# Altium project FYP_Protoboard1.PrjPcb
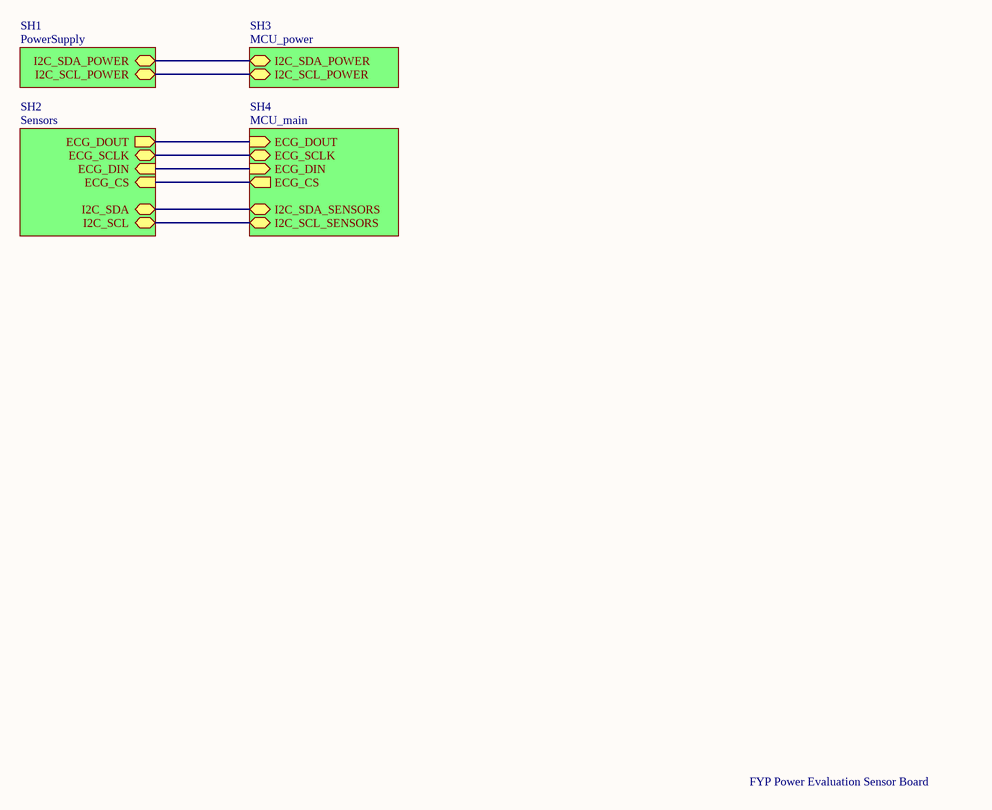
[diagram p0: Sensors_Power_Characterisation_Board.SchDoc]
Author: Petar Barakov; Revision: Rev 1
4 sheets, 126 parts. Net scope: hierarchical (ports join the sheet entries above them; power ports are global).
Board file: Sensors_Power_Characterisation_Board.PcbDoc
Sheets:
  Sensors_Power_Characterisation_Board.SchDoc
    SH1 = PowerSupply.SchDoc
    SH2 = Sensors.SchDoc
    SH4 = MCU_main.SchDoc

## Sheet Sensors_Power_Characterisation_Board.SchDoc
size A4; SheetNumber: 1; SheetTotal: 5

### Sub-sheets
SH1 = PowerSupply: I2C_SDA_POWER (bidir), I2C_SCL_POWER (bidir)
SH2 = Sensors: ECG_DOUT (out), ECG_SCLK (bidir), ECG_DIN (in), ECG_CS (in), I2C_SCL (bidir), I2C_SDA (bidir)
SH3 = MCU_power (file not in this document): I2C_SDA_POWER (bidir), I2C_SCL_POWER (bidir)
SH4 = MCU_main: ECG_DIN (in), ECG_CS (out), ECG_SCLK (bidir), I2C_SDA_SENSORS (bidir), I2C_SCL_SENSORS (bidir), ECG_DOUT (in)

### Nets
ECG_CS: sheet SH2/ECG_CS, sheet SH4/ECG_CS
ECG_DIN: sheet SH2/ECG_DIN, sheet SH4/ECG_DIN
ECG_DOUT: sheet SH2/ECG_DOUT, sheet SH4/ECG_DOUT
ECG_SCLK: sheet SH2/ECG_SCLK, sheet SH4/ECG_SCLK
I2C_SCL: sheet SH2/I2C_SCL, sheet SH4/I2C_SCL_SENSORS
I2C_SCL_POWER: sheet SH1/I2C_SCL_POWER, sheet SH3/I2C_SCL_POWER
I2C_SDA: sheet SH2/I2C_SDA, sheet SH4/I2C_SDA_SENSORS
I2C_SDA_POWER: sheet SH1/I2C_SDA_POWER, sheet SH3/I2C_SDA_POWER

### Notes on the sheet
- FYP Power Evaluation Sensor Board

## Sheet PowerSupply.SchDoc
size A4; SheetNumber: 3; SheetTotal: 5
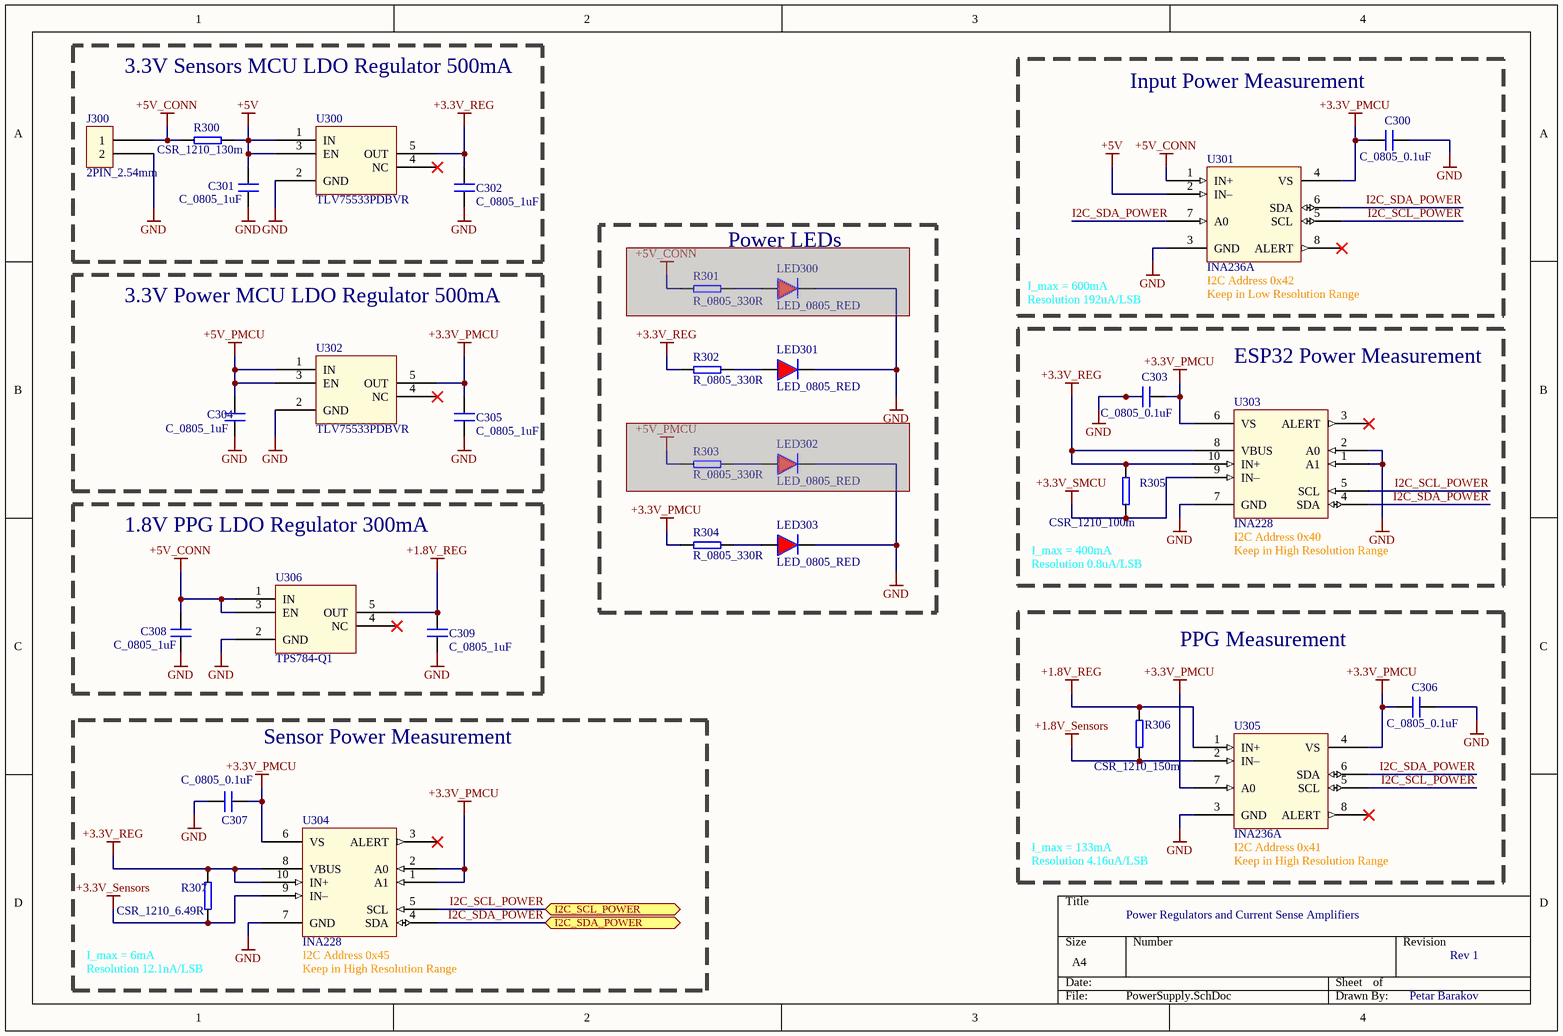
[diagram p1: PowerSupply.SchDoc]

### Parts
C300  C_0805_0.1uF  [CAP_0805]
C301  C_0805_1uF  [CAP_0805]
C302  C_0805_1uF  [CAP_0805]
C303  C_0805_0.1uF  [CAP_0805]
C304  C_0805_1uF  [CAP_0805]
C305  C_0805_1uF  [CAP_0805]
C306  C_0805_0.1uF  [CAP_0805]
C307  C_0805_0.1uF  [CAP_0805]
C308  C_0805_1uF  [CAP_0805]
C309  C_0805_1uF  [CAP_0805]
J300  2PIN_2.54mm  [2PIN_2.54mm-Footprint-1]
LED300  LED_0805_RED  [LED_0806]  (masked out: inside a compile mask, not in the netlist)
LED301  LED_0805_RED  [LED_0806]
LED302  LED_0805_RED  [LED_0806]  (masked out: inside a compile mask, not in the netlist)
LED303  LED_0805_RED  [LED_0806]
R300  CSR_1210_130m  [CSR_1210]
R301  R_0805_330R  [0805_RES]  (masked out: inside a compile mask, not in the netlist)
R302  R_0805_330R  [0805_RES]
R303  R_0805_330R  [0805_RES]  (masked out: inside a compile mask, not in the netlist)
R304  R_0805_330R  [0805_RES]
R305  CSR_1210_100m  [CSR_1210]
R306  CSR_1210_150m  [CSR_1210]
R307  CSR_1210_6.49R  [CSR_1210]
U300  TLV75533PDBVR  [SOT95P280X145-5N]
U301  INA236A  [INA236A-Footprint-1]
U302  TLV75533PDBVR  [SOT95P280X145-5N]
U303  INA228  [TSSOP50P490X110-10N]
U304  INA228  [TSSOP50P490X110-10N]
U305  INA236A  [INA236A-Footprint-1]
U306  TPS784-Q1  [SOT95P280X145-5N]

### Blocks framed on the sheet
3.3V Sensors MCU LDO Regulator 500mA: C301 C302 J300 R300 U300
Input Power Measurement: C300 U301
Power LEDs: LED300-LED303 R301-R304
3.3V Power MCU LDO Regulator 500mA: C304 C305 U302
ESP32 Power Measurement: C303 R305 U303
1.8V PPG LDO Regulator 300mA: C308 C309 U306
PPG Measurement: C306 R306 U305
Sensor Power Measurement: C307 R307 U304

### Ports
I2C_SCL_POWER (bidir, see Sensors_Power_Characterisation_Board[2A], MCU_power[1A]), I2C_SDA_POWER (bidir, see Sensors_Power_Characterisation_Board[2A], MCU_power[1A])

### Nets
+1.8V_REG: C309.2 R306.1 U305.1(IN+) U306.5(OUT)
+1.8V_Sensors: R306.2 U305.2(IN–)
+3.3V_PMCU: C300.1 C303.2 C305.2 C306.1 C307.1 R304.2 U301.4(VS) U302.5(OUT) U303.6(VS) U304.1(A1) U304.2(A0) U304.6(VS) U305.4(VS) U305.7(A0)
+3.3V_REG: C302.2 R302.2 R305.1 R307.1 U300.5(OUT) U303.8(VBUS) U303.10(IN+) U304.8(VBUS) U304.10(IN+)
+3.3V_Sensors: R307.2 U304.9(IN–)
+3.3V_SMCU: R305.2 U303.9(IN–)
+5V: C301.2 R300.1 U300.1(IN) U300.3(EN) U301.2(IN–)
+5V_CONN: C308.2 J300.1 R300.2 U301.1(IN+) U306.1(IN) U306.3(EN)
+5V_PMCU: C304.2 U302.1(IN) U302.3(EN)
GND: C300.2 C301.1 C302.1 C303.1 C304.1 C305.1 C306.2 C307.2 C308.1 C309.1 J300.2 LED301.1 LED303.1 U300.2(GND) U301.3(GND) U302.2(GND) U303.1(A1) U303.2(A0) U303.7(GND) U304.7(GND) U305.3(GND) U306.2(GND)
I2C_SCL_POWER: U301.5(SCL) U303.5(SCL) U304.5(SCL) U305.5(SCL) ; port I2C_SCL_POWER
I2C_SDA_POWER: U301.6(SDA) U301.7(A0) U303.4(SDA) U304.4(SDA) U305.6(SDA) ; port I2C_SDA_POWER
NetLED301_2: LED301.2 R302.1
NetLED303_2: LED303.2 R304.1

Not connected (* = marked no-connect by the designer): U300 4(NC)*; U301 8(ALERT)*; U302 4(NC)*; U303 3(ALERT)*; U304 3(ALERT)*; U305 8(ALERT)*; U306 4(NC)*

### Notes on the sheet
- Resolution 192uA/LSB
- I_max = 600mA
- (near U301) I2C Address 0x42
- (near U301) Keep in Low Resolution Range
- Resolution 0.8uA/LSB
- (near R305) I_max = 400mA
- (near U303) I2C Address 0x40
- (near U303) Keep in High Resolution Range
- I_max = 133mA
- (near U305) I2C Address 0x41
- Resolution 4.16uA/LSB
- Power Regulators and Current Sense Amplifiers
- (near U305) Keep in High Resolution Range
- Resolution 12.1nA/LSB
- I_max = 6mA
- (near U304) I2C Address 0x45
- (near U304) Keep in High Resolution Range

### Library data of the parts
C300 C303 C306 C307 = CMP-00002-3: JLC Part Number: C28233
C301 C302 C304 C305 C308 C309 = CMP-00004-3: JLC Part Number: C28323
J300 = CMP-00018-3: 2 pin power input; JLC Part Number: C5360898
LED300-LED303 = CMP-00021-4: LED, Red, SMD, 0805 [2012 Metric], 30 mA, 2 V, 625 nm; Order Code: 2322077; Distributor: Farnell; JLC Part Number: C94741
R300 = CMP-00045-3: Current Sense Resistors - SMD RLC73K 2E R13 1% 1K RL  RLC73K2ER13FTDF; Order Code: 279-RLC73K2ER13FTDF; Distributor: Mouser; JLC Part Number: C175909
R301-R304 = CMP-00022-2: JLC Part Number: C17630
R305 = CMP-00046-2: Current Sense Resistors - SMD RLC73PW 2E R10 1% 1K RL, RLC73PW2ER10FTDF; Order Code: 279-RLC73PW2ER10FTDF; Distributor: Mouser; JLC Part Number: C160924
R306 = CMP-00035-2: Current Sense Resistors - SMD RL73H 2E R15 1%5K RL, 150mOhms; Order Code: 279-RL73H2ER15FTD; Distributor: Mouser; JLC Part Number: C186626
R307 = CMP-00044-2: Current Sense Resistors - SMD 6.49ohms 1% 100 PPM SR732ETTE6R49F; Order Code: 660-SR732ETTE6R49F; Distributor: Mouser
U300 U302 = CMP-00019-2: LDO Voltage Regulators 500-mA high-PSRR low-IQ low-dropout voltage regulator with enable 5-SOT-23 -40 to 125; JLC Part Number: C404027
U301 U305 = CMP-00031-4: Current & Power Monitors & Regulators 48-V, 16-bit ultraprecise I²C output digital power monitor with alert in WCSP 8-SOT-23-THIN -40 to 125; Order Code: 595-INA236AIDDFR; Distributor: Mouser; JLC Part Number: C5443912
U303 U304 = CMP-00042-2: Current & Power Monitors & Regulators AEC-Q100, 85-V, 20-bit, ultraprecise, I²C output current/voltage/power/energy/charge monitor 10-VSSOP -40 to 125; Order Code: 595-INA228AQDGSRQ1; Distributor: Mouser
U306 = CMP-00023-2: LDO Voltage Regulators Automotive, 300-mA, low-IQ, high-PSRR, LDO voltage regulator with high accuracy and enable 5-SOT-23 -40 to 150; Order Code: 595-TPS78418QDBVRQ1; Distributor: Mouser; JLC Part Number: C2877783

## Sheet Sensors.SchDoc
size A4; SheetNumber: 2; SheetTotal: 5
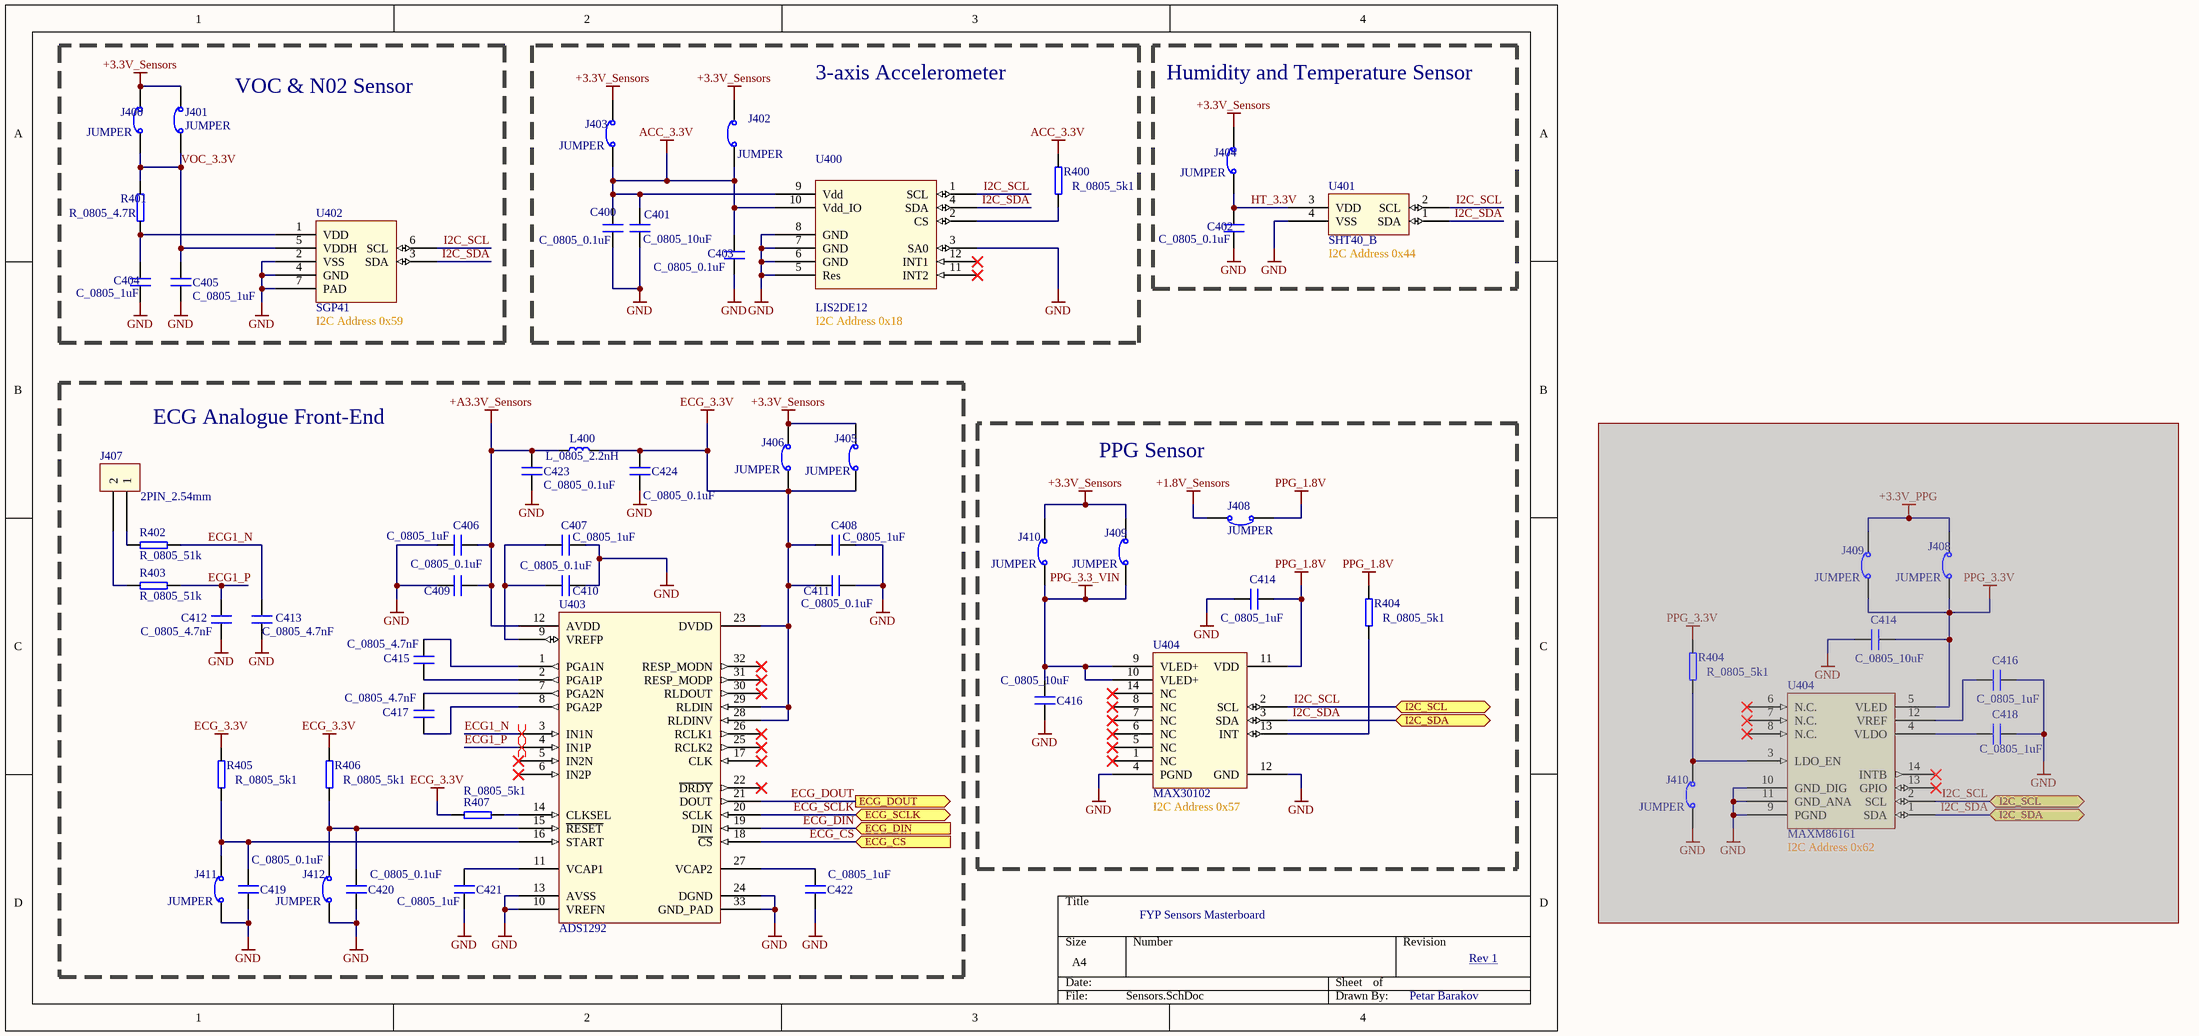
[diagram p2: Sensors.SchDoc]

### Parts
(Parts that share a designator on the sheet are numbered #1, #2 ... from top to bottom, then left to right.)
C400  C_0805_0.1uF  [CAP_0805]
C401  C_0805_10uF  [CAP_0805]
C402  C_0805_0.1uF  [CAP_0805]
C403  C_0805_0.1uF  [CAP_0805]
C404  C_0805_1uF  [CAP_0805]
C405  C_0805_1uF  [CAP_0805]
C406  C_0805_1uF  [CAP_0805]
C407  C_0805_1uF  [CAP_0805]
C408  C_0805_1uF  [CAP_0805]
C409  C_0805_0.1uF  [CAP_0805]
C410  C_0805_0.1uF  [CAP_0805]
C411  C_0805_0.1uF  [CAP_0805]
C412  C_0805_4.7nF  [CAP_0805]
C413  C_0805_4.7nF  [CAP_0805]
C414#1  C_0805_1uF  [CAP_0805]
C414#2  C_0805_10uF  [CAP_0805]  (masked out: inside a compile mask, not in the netlist)
C415  C_0805_4.7nF  [CAP_0805]
C416#1  C_0805_1uF  [CAP_0805]  (masked out: inside a compile mask, not in the netlist)
C416#2  C_0805_10uF  [CAP_0805]
C417  C_0805_4.7nF  [CAP_0805]
C418  C_0805_1uF  [CAP_0805]  (masked out: inside a compile mask, not in the netlist)
C419  C_0805_0.1uF  [CAP_0805]
C420  C_0805_0.1uF  [CAP_0805]
C421  C_0805_1uF  [CAP_0805]
C422  C_0805_1uF  [CAP_0805]
C423  C_0805_0.1uF  [CAP_0805]
C424  C_0805_0.1uF  [CAP_0805]
J400  JUMPER  [2PIN_2.54mm-Footprint-1]
J401  JUMPER  [2PIN_2.54mm-Footprint-1]
J402  JUMPER  [2PIN_2.54mm-Footprint-1]
J403  JUMPER  [2PIN_2.54mm-Footprint-1]
J404  JUMPER  [2PIN_2.54mm-Footprint-1]
J405  JUMPER  [2PIN_2.54mm-Footprint-1]
J406  JUMPER  [2PIN_2.54mm-Footprint-1]
J407  2PIN_2.54mm  [2PIN_2.54mm-Footprint-1]
J408#1  JUMPER  [2PIN_2.54mm-Footprint-1]
J408#2  JUMPER  [2PIN_2.54mm-Footprint-1]  (masked out: inside a compile mask, not in the netlist)
J409#1  JUMPER  [2PIN_2.54mm-Footprint-1]
J409#2  JUMPER  [2PIN_2.54mm-Footprint-1]  (masked out: inside a compile mask, not in the netlist)
J410#1  JUMPER  [2PIN_2.54mm-Footprint-1]
J410#2  JUMPER  [2PIN_2.54mm-Footprint-1]  (masked out: inside a compile mask, not in the netlist)
J411  JUMPER  [2PIN_2.54mm-Footprint-1]
J412  JUMPER  [2PIN_2.54mm-Footprint-1]
L400  L_0805_2.2nH  [L_0805]
R400  R_0805_5k1  [0805_RES]
R401  R_0805_4.7R  [0805_RES]
R402  R_0805_51k  [0805_RES]
R403  R_0805_51k  [0805_RES]
R404#1  R_0805_5k1  [0805_RES]
R404#2  R_0805_5k1  [0805_RES]  (masked out: inside a compile mask, not in the netlist)
R405  R_0805_5k1  [0805_RES]
R406  R_0805_5k1  [0805_RES]
R407  R_0805_5k1  [0805_RES]
U400  LIS2DE12  [LIS2DE12-Footprint-1]
U401  SHT40_B  [SHT40_B-Footprint-1]
U402  SGP41  [SGP41-D-R4-Footprint-2]
U403  ADS1292  [QFN127P600-8N]
U404#1  MAX30102  [MAX30102-Footprint-1]
U404#2  MAXM86161  (masked out: inside a compile mask, not in the netlist)

### Blocks framed on the sheet
VOC & N02 Sensor: C404 C405 J400 J401 R401 U402
3-axis Accelerometer: C400 C401 C403 J402 J403 R400 U400
Humidity and Temperature Sensor: C402 J404 U401
ECG Analogue Front-End: C406-C413 C415 C417 C419-C424 J405-J407 J411 J412 L400 R402 R403 R405-R407 U403
PPG Sensor: C414#1 C416#2 J408#1 J409#1 J410#1 R404#1 U404#1

### Ports
ECG_CS (in, see Sensors_Power_Characterisation_Board[2B], MCU_main[4B]), ECG_DIN (in, see Sensors_Power_Characterisation_Board[2B], MCU_main[4B]), ECG_DOUT (out, see Sensors_Power_Characterisation_Board[2B], MCU_main[2B]), ECG_SCLK (bidir, see Sensors_Power_Characterisation_Board[2B], MCU_main[2B]), I2C_SCL (bidir, see Sensors_Power_Characterisation_Board[2B]), I2C_SDA (bidir, see Sensors_Power_Characterisation_Board[2B])

### Nets
+1.8V_Sensors: J408#1.2
+3.3V_Sensors: J400.2 J401.2 J402.2 J403.2 J404.2 J405.2 J406.2 J409#1.2 J410#1.2
+A3.3V_Sensors: C406.2 C409.2 C423.2 L400.1 U403.12(AVDD)
ACC_3.3V: C400.2 C401.2 C403.2 J402.1 J403.1 R400.2 U400.9(Vdd) U400.10(Vdd_IO)
ECG_3.3V: C408.1 C411.1 C424.2 J405.1 J406.1 L400.2 R405.2 R406.2 R407.2 U403.23(DVDD) U403.28(RLDINV) U403.29(RLDIN)
GND: C400.1 C401.1 C402.1 C403.1 C404.1 C405.1 C406.1 C407.1 C408.2 C409.1 C410.1 C411.2 C412.1 C413.1 C414#1.1 C416#2.1 C419.1 C420.1 C421.1 C422.1 C423.1 C424.1 J411.1 J412.1 U400.3(SA0) U400.5(Res) U400.6(GND) U400.7(GND) U400.8(GND) U401.4(VSS) U402.2(VSS) U402.4(GND) U402.7(PAD) U403.10(VREFN) U403.13(AVSS) U403.24(DGND) U403.33(GND_PAD) U404#1.4(PGND) U404#1.12(GND)
PPG_1.8V: C414#1.2 J408#1.1 R404#1.2 U404#1.11(VDD)
PPG_3.3_VIN: C416#2.2 J409#1.1 J410#1.1 U404#1.9(VLED+) U404#1.10(VLED+)
ECG1_N: C413.2 R402.1 U403.3(IN1N)
ECG1_P: C412.2 R403.1 U403.4(IN1P)
ECG_CS: U403.18(~{CS}) ; port ECG_CS
ECG_DIN: U403.19(DIN) ; port ECG_DIN
ECG_DOUT: U403.21(DOUT) ; port ECG_DOUT
ECG_SCLK: U403.20(SCLK) ; port ECG_SCLK
HT_3.3V: C402.2 J404.1 U401.3(VDD)
I2C_SCL: U400.1(SCL) U401.2(SCL) U402.6(SCL) U404#1.2(SCL) ; port I2C_SCL
I2C_SDA: U400.4(SDA) U401.1(SDA) U402.3(SDA) U404#1.3(SDA) ; port I2C_SDA
VOC_3.3V: C405.2 J400.1 J401.1 R401.1 U402.5(VDDH)
NetC404_2: C404.2 R401.2 U402.1(VDD)
NetC407_2: C407.2 C410.2 U403.9(VREFP)
NetC415_1: C415.1 U403.2(PGA1P)
NetC415_2: C415.2 U403.1(PGA1N)
NetC417_1: C417.1 U403.8(PGA2P)
NetC417_2: C417.2 U403.7(PGA2N)
NetC419_2: C419.2 J411.2 R405.1 U403.16(START)
NetC420_2: C420.2 J412.2 R406.1 U403.15(~{RESET})
NetC421_2: C421.2 U403.11(VCAP1)
NetC422_2: C422.2 U403.27(VCAP2)
NetJ407_1: J407.1 R402.2
NetJ407_2: J407.2 R403.2
NetR400_1: R400.1 U400.2(CS)
NetR404#1_1: R404#1.1 U404#1.13(INT)
NetR407_1: R407.1 U403.14(CLKSEL)

Not connected (* = marked no-connect by the designer): U400 11(INT2)* 12(INT1)*; U403 5(IN2N)* 6(IN2P)* 17(CLK)* 22(~{DRDY})* 25(RCLK2)* 26(RCLK1)* 30(RLDOUT)* 31(RESP_MODP)* 32(RESP_MODN)*; U404#1 1(NC)* 5(NC)* 6(NC)* 7(NC)* 8(NC)* 14(NC)*

### Layout directives
differential pair: ECG1_N, ECG1_P

### Notes on the sheet
- (near U401) I2C Address 0x44
- (near U402) I2C Address 0x59
- (near U400) I2C Address 0x18
- (near U404#1) I2C Address 0x57
- (near U404#2) I2C Address 0x62
- FYP Sensors Masterboard

### Library data of the parts
C400 C402 C403 C409-C411 C419 C420 C423 C424 = CMP-00002-3: JLC Part Number: C28233
C401 C414#2 C416#2 = CMP-00006-2: JLC Part Number: C15850
C404-C408 C414#1 C416#1 C418 C421 C422 = CMP-00004-3: JLC Part Number: C28323
C412 C413 C415 C417 = CMP-00027-3: JLC Part Number: C1744
J400-J406 J408#1 J408#2 J409#1 J409#2 J410#1 J410#2 J411 J412 = CMP-00028-2: 2 pin jumper; JLC Part Number: C5360898
J407 = CMP-00018-3: 2 pin power input; JLC Part Number: C5360898
L400 = CMP-00011-3: Required a minimum current of 500mA and a resonant frequrency of at least 6GHz; JLC Part Number: C964055
R400 R404#1 R404#2 R405-R407 = CMP-00014-2: JLC Part Number: C27834
R401 = CMP-00007-3: JLC Part Number: C17675
R402 R403 = CMP-00039-2: JLC Part Number: C17737
U400 = CMP-00005-10: Accelerometers MEMS digital output motion sensor: ultra-low-power high-performance 3-axis "femt; Order Code: 511-LIS2DE12TR; JLC Part Number: C155639; Distributor: Mouser
U401 = CMP-00001-4: Board Mount Humidity Sensors +/-1.8%RH/+/-0.2C, 4th generation, digital (I2C) humidity and temperature sensor with 0x45 I2C address.; JLC Part Number: C3664342
U402 = CMP-00000-7: Air Quality Sensors VOC and NOx (MOX) Gas Pollutant Sensor; Order Code: 403-SGP41-D-R4; JLC Part Number: C3659325; Distributor: Mouser
U403 = CMP-00026-5: ECG Analog Front End - AFE 2-Channel,24B ADC; Order Code: 595-ADS1292RIRSMT; Distributor: Mouser; JLC Part Number: C456281
U404#1 = CMP-00048-2: Biometric Sensors Integrated Optical Sensor; Order Code: 700-MAX30102EFD+T; JLC Part Number: C6454833; Distributor: Mouser
U404#2 = CMP-00041-1: PPG Biometric Sensors Optical Bio Sensor Module Optimized for Wearables; Order Code: 700-MAXM86161EFD+T; Distributor: Mouser

## Sheet MCU_main.SchDoc
size A4; SheetNumber: 4; SheetTotal: 5
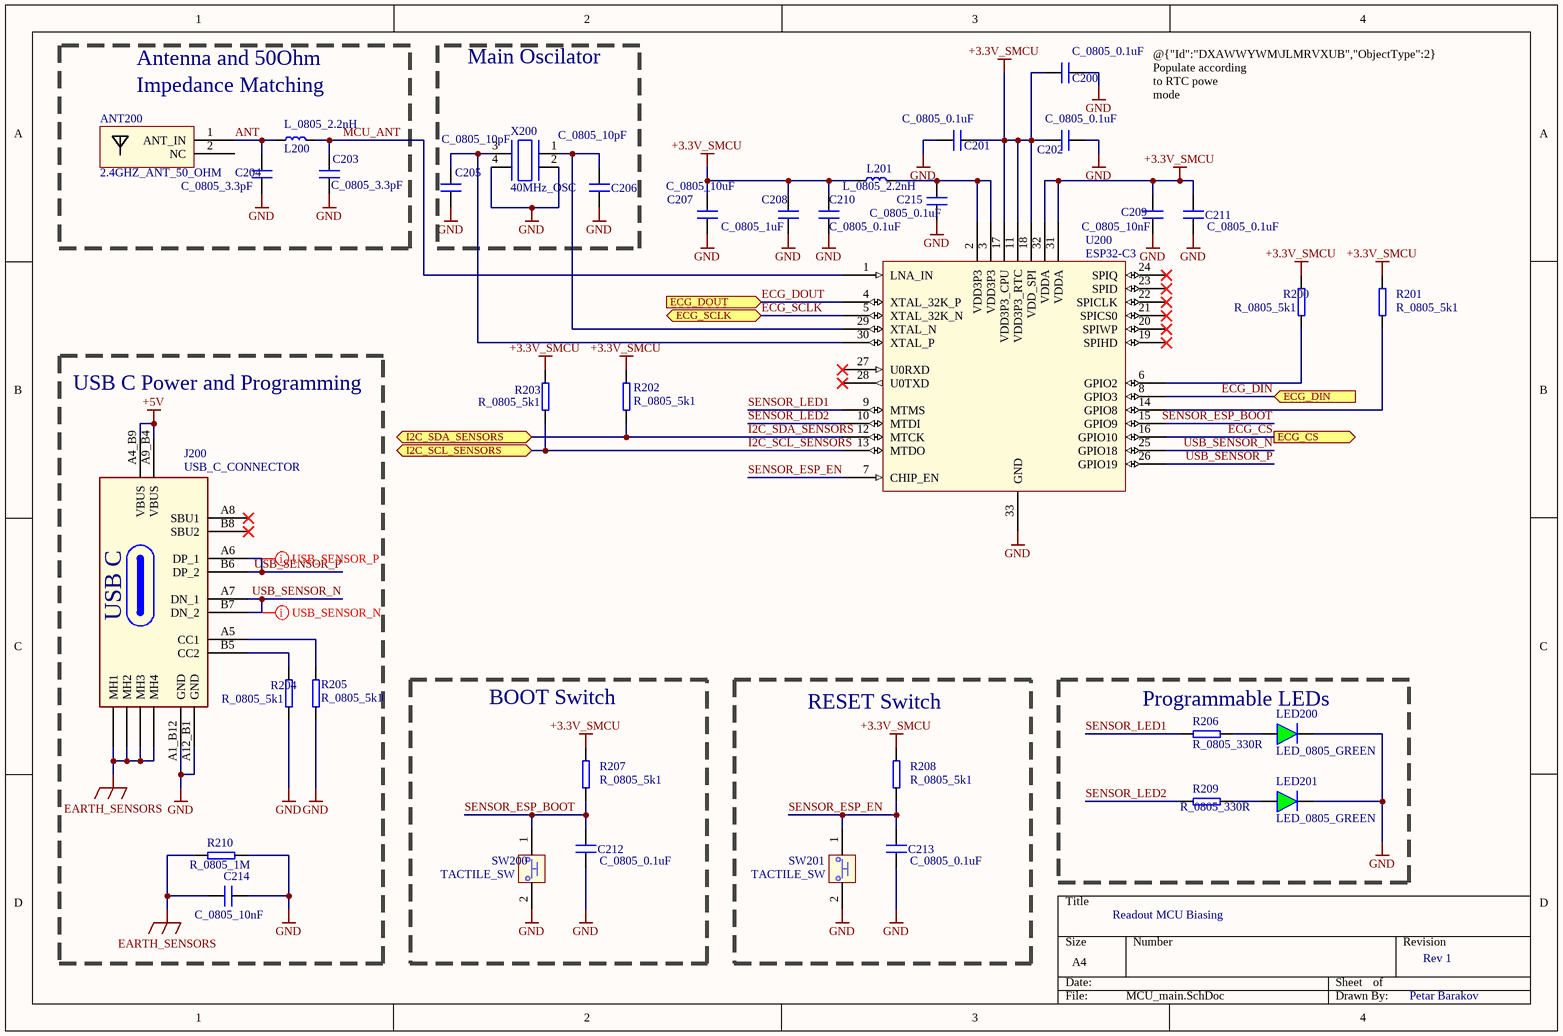
[diagram p3: MCU_main.SchDoc]

### Parts
ANT200  2.4GHZ_ANT_50_OHM  [Chip2PinSM127P600-8N]
C200  C_0805_0.1uF  [CAP_0805]
C201  C_0805_0.1uF  [CAP_0805]
C202  C_0805_0.1uF  [CAP_0805]
C203  C_0805_3.3pF  [CAP_0805]
C204  C_0805_3.3pF  [CAP_0805]
C205  C_0805_10pF  [CAP_0805]
C206  C_0805_10pF  [CAP_0805]
C207  C_0805_10uF  [CAP_0805]
C208  C_0805_1uF  [CAP_0805]
C209  C_0805_10nF  [CAP_0805]
C210  C_0805_0.1uF  [CAP_0805]
C211  C_0805_0.1uF  [CAP_0805]
C212  C_0805_0.1uF  [CAP_0805]
C213  C_0805_0.1uF  [CAP_0805]
C214  C_0805_10nF  [CAP_0805]
C215  C_0805_0.1uF  [CAP_0805]
J200  USB_C_CONNECTOR  [USB_C_CONNECTOR-Footprint-1]
L200  L_0805_2.2nH  [L_0805]
L201  L_0805_2.2nH  [L_0805]
LED200  LED_0805_GREEN  [LED_0806]
LED201  LED_0805_GREEN  [LED_0806]
R200  R_0805_5k1  [0805_RES]
R201  R_0805_5k1  [0805_RES]
R202  R_0805_5k1  [0805_RES]
R203  R_0805_5k1  [0805_RES]
R204  R_0805_5k1  [0805_RES]
R205  R_0805_5k1  [0805_RES]
R206  R_0805_330R  [0805_RES]
R207  R_0805_5k1  [0805_RES]
R208  R_0805_5k1  [0805_RES]
R209  R_0805_330R  [0805_RES]
R210  R_0805_1M  [0805_RES]
SW200  TACTILE_SW  [TACTILE_SW-Footprint-1]
SW201  TACTILE_SW  [TACTILE_SW-Footprint-1]
U200  ESP32-C3  [QFN127P600-8N]
X200  40MHz_OSC  [40MHz_OSC-Footprint-1]

### Blocks framed on the sheet
Main Oscilator: C205 C206 X200
USB C Power and Programming: C214 J200 R204 R205 R210
BOOT Switch: C212 R207 SW200
RESET Switch: C213 R208 SW201
Programmable LEDs: LED200 LED201 R206 R209

### Ports
ECG_CS (out, see Sensors_Power_Characterisation_Board[2B], Sensors[3D]), ECG_DIN (in, see Sensors_Power_Characterisation_Board[2B], Sensors[3D]), ECG_DOUT (in, see Sensors_Power_Characterisation_Board[2B], Sensors[3D]), ECG_SCLK (bidir, see Sensors_Power_Characterisation_Board[2B], Sensors[3D]), I2C_SCL_SENSORS (bidir, see Sensors_Power_Characterisation_Board[2B]), I2C_SDA_SENSORS (bidir, see Sensors_Power_Characterisation_Board[2B])

### Nets
+3.3V_SMCU: C200.1 C201.2 C202.1 C207.2 C208.2 C209.2 C210.1 C211.2 L201.1 R200.1 R201.1 R202.1 R203.1 R207.1 R208.1 U200.11(VDD3P3_RTC) U200.17(VDD3P3_CPU) U200.18(VDD_SPI) U200.31(VDDA) U200.32(VDDA)
+5V: J200.A4_B9(VBUS) J200.A9_B4(VBUS)
EARTH_SENSORS: C214.1 J200.MH1 J200.MH2 J200.MH3 J200.MH4 R210.2
GND: C200.2 C201.1 C202.2 C203.1 C204.1 C205.1 C206.1 C207.1 C208.1 C209.1 C210.2 C211.1 C212.1 C213.1 C214.2 C215.2 J200.A1_B12(GND) J200.A12_B1(GND) LED200.1 LED201.1 R204.2 R205.2 R210.1 SW200.2 SW201.2 U200.33(GND) X200.2 X200.4
ANT: ANT200.1(ANT_IN) C204.2 L200.1
ECG_CS: U200.16(GPIO10) ; port ECG_CS
ECG_DIN: U200.8(GPIO3) ; port ECG_DIN
ECG_DOUT: U200.4(XTAL_32K_P) ; port ECG_DOUT
ECG_SCLK: U200.5(XTAL_32K_N) ; port ECG_SCLK
I2C_SCL_SENSORS: R203.2 U200.13(MTDO) ; port I2C_SCL_SENSORS  [project net I2C_SCL]
I2C_SDA_SENSORS: R202.2 U200.12(MTCK) ; port I2C_SDA_SENSORS  [project net I2C_SDA]
MCU_ANT: C203.2 L200.2 U200.1(LNA_IN)
SENSOR_ESP_BOOT: C212.2 R207.2 SW200.1 U200.15(GPIO9)
SENSOR_ESP_EN: C213.2 R208.2 SW201.1 U200.7(CHIP_EN)
SENSOR_LED1: R206.2 U200.9(MTMS)
SENSOR_LED2: R209.2 U200.10(MTDI)
USB_SENSOR_N: J200.A7(DN_1) J200.B7(DN_2) U200.25(GPIO18)
USB_SENSOR_P: J200.A6(DP_1) J200.B6(DP_2) U200.26(GPIO19)
NetC205_2: C205.2 U200.30(XTAL_P) X200.3
NetC206_2: C206.2 U200.29(XTAL_N) X200.1
NetC215_1: C215.1 L201.2 U200.2(VDD3P3) U200.3(VDD3P3)
NetJ200_A5: J200.A5(CC1) R205.1
NetJ200_B5: J200.B5(CC2) R204.1
NetLED200_2: LED200.2 R206.1
NetLED201_2: LED201.2 R209.1
NetR200_2: R200.2 U200.6(GPIO2)
NetR201_2: R201.2 U200.14(GPIO8)

Not connected (* = marked no-connect by the designer): ANT200 2(NC); J200 A8(SBU1)* B8(SBU2)*; U200 19(SPIHD)* 20(SPIWP)* 21(SPICS0)* 22(SPICLK)* 23(SPID)* 24(SPIQ)* 27(U0RXD)* 28(U0TXD)*

### Layout directives
differential pair: USB_SENSOR_N, USB_SENSOR_P

### Notes on the sheet
- Antenna and 50Ohm
- Impedance Matching
- @{"Id":"DXAWWYWM\JLMRVXUB","ObjectType":2}  Populate according to RTC powe mode configurations
- Readout MCU Biasing
- (in symbol CMP-00013-4) USB C

### Library data of the parts
ANT200 = CMP-00009-6: 2.4GHz Chip Antenna 50 Ohm Impedance ANT2012LL00R2400A; Order Code: 603-ANT2012LL00R2400; Distributor: Mouser
C200-C202 C210-C213 C215 = CMP-00002-3: JLC Part Number: C28233
C203 C204 = CMP-00010-2: 3.3pF Capaciror; JLC Part Number: C1811
C205 C206 = CMP-00016-3: JLC Part Number: C107107
C207 = CMP-00006-2: JLC Part Number: C15850
C208 = CMP-00004-3: JLC Part Number: C28323
C209 C214 = CMP-00012-2: JLC Part Number: C1710
J200 = CMP-00013-4: USB2.0, Type C, Top Mount, Ch 1.68MM, Dual Row SMT / Tap/rl; Order Code: 538-217179-0001; JLC Part Number: C2831450; Distributor: Mouser
L200 L201 = CMP-00011-3: as L400 on sheet Sensors; JLC Part Number: C964055
LED200 LED201 = CMP-00020-3: LED, Green, SMD, 0805 [2012 Metric], 30 mA, 2 V, 570 nm; Order Code: 2322081; Distributor: Farnell; JLC Part Number: C2297
R200-R205 R207 R208 = CMP-00014-2: JLC Part Number: C27834
R206 R209 = CMP-00022-2: JLC Part Number: C17630
R210 = CMP-00037-3: JLC Part Number: C131391
SW200 SW201 = CMP-00017-2: Keypad Switch, 1 Switches, SPST, Momentary-tactile, 0.05A, 12VDC, 2.94N, Solder Terminal, Surface Mount-straight; JLC Part Number: C455280
U200 = CMP-00008-4: 33 pin ESP32_C3 Microcontroller; JLC Part Number: C2858491
X200 = CMP-00029-2: 40 MHZ Oscillator, 10pF load capacitance; JLC Part Number: C426988

## Nets that join several sheets
+1.8V_Sensors: PowerSupply (R306.2 U305.2), Sensors (J408#1.2)
+3.3V_Sensors: PowerSupply (R307.2 U304.9), Sensors (9 pins)
+3.3V_SMCU: PowerSupply (R305.2 U303.9), MCU_main (20 pins)
+5V: PowerSupply (5 pins), MCU_main (J200.A4_B9 J200.A9_B4)
GND: PowerSupply (22 pins), Sensors (39 pins), MCU_main (28 pins)
ECG_CS: Sensors (U403.18), MCU_main (U200.16)
ECG_DIN: Sensors (U403.19), MCU_main (U200.8)
ECG_DOUT: Sensors (U403.21), MCU_main (U200.4)
ECG_SCLK: Sensors (U403.20), MCU_main (U200.5)
I2C_SCL: Sensors (U400.1 U401.2 U402.6 U404#1.2), MCU_main (R203.2 U200.13)
I2C_SDA: Sensors (U400.4 U401.1 U402.3 U404#1.3), MCU_main (R202.2 U200.12)